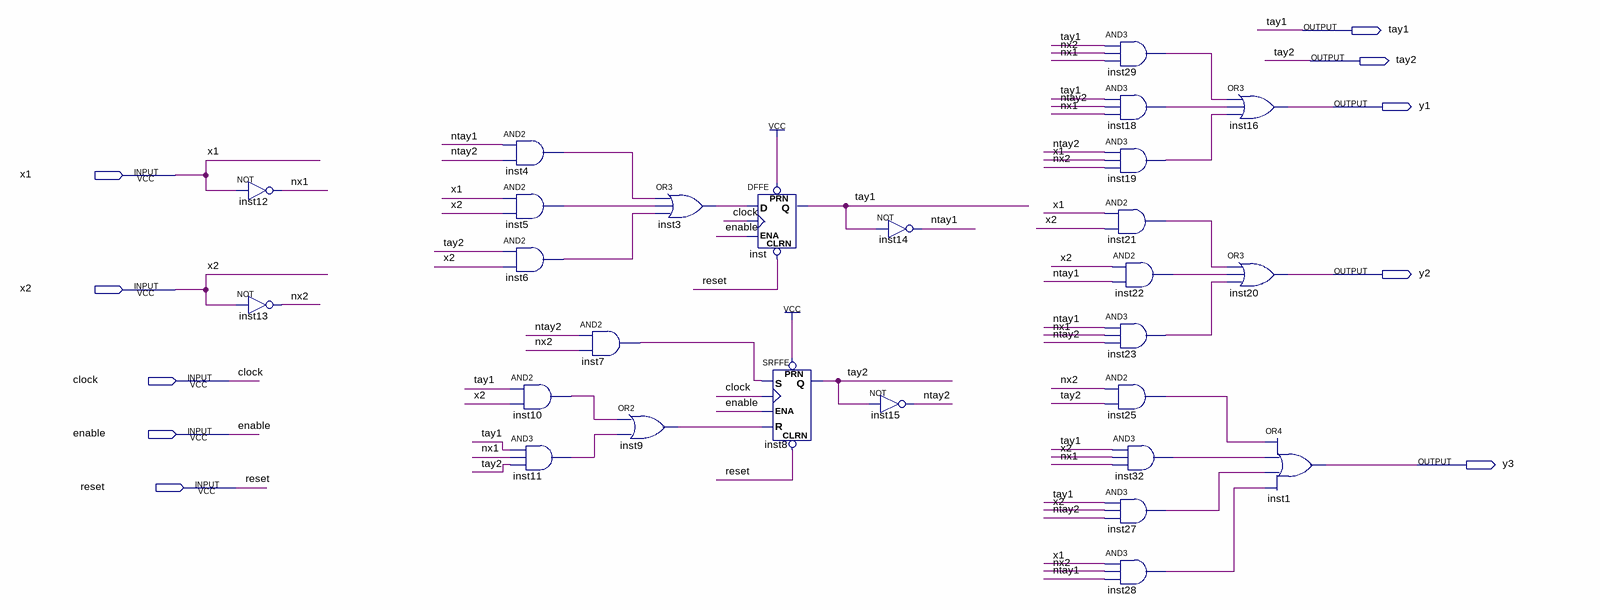
[diagram p0: schematic sheet]
// Quartus schematic avtomat_mili.bdf as structural Verilog: 27 symbols, 10 pins
module avtomat_mili (
  input  x1,
  input  x2,
  input  clock,
  input  enable,
  input  reset,
  output tay1,
  output tay2,
  output y1,
  output y2,
  output y3
);

  wire inst3_out, inst4_out, inst5_out, inst6_out, inst7_out, inst9_out, inst10_out, inst11_out, inst18_out,
       inst19_out, inst21_out, inst22_out, inst23_out, inst25_out, inst27_out, inst28_out, inst29_out,
       inst32_out, ntay1, ntay2, nx1, nx2;

  not inst12 (nx1, x1);
  not inst13 (nx2, x2);
  and inst4 (inst4_out, ntay1, ntay2);
  and inst5 (inst5_out, x1, x2);
  and inst6 (inst6_out, tay2, x2);
  and inst10 (inst10_out, tay1, x2);
  and inst11 (inst11_out, tay1, nx1, tay2);
  and inst7 (inst7_out, ntay2, nx2);
  or inst9 (inst9_out, inst10_out, inst11_out);
  or inst3 (inst3_out, inst4_out, inst5_out, inst6_out);
  DFFE inst (.PRN(1'b1), .CLRN(reset), .D(inst3_out), .CLK(clock), .ENA(enable), .Q(tay1));
  SRFFE inst8 (.PRN(1'b1), .S(inst7_out), .CLK(clock), .CLRN(reset), .R(inst9_out), .ENA(enable), .Q(tay2));
  not inst14 (ntay1, tay1);
  not inst15 (ntay2, tay2);
  and inst29 (inst29_out, tay1, nx2, nx1);
  and inst18 (inst18_out, tay1, ntay2, nx1);
  and inst19 (inst19_out, ntay2, x1, nx2);
  and inst21 (inst21_out, x1, x2);
  and inst22 (inst22_out, x2, ntay1);
  and inst23 (inst23_out, ntay1, nx1, ntay2);
  and inst25 (inst25_out, nx2, tay2);
  and inst32 (inst32_out, tay1, x2, nx1);
  and inst27 (inst27_out, tay1, x2, ntay2);
  and inst28 (inst28_out, x1, nx2, ntay1);
  or inst16 (y1, inst29_out, inst18_out, inst19_out);
  or inst20 (y2, inst21_out, inst22_out, inst23_out);
  or inst1 (y3, inst25_out, inst32_out, inst27_out, inst28_out);
endmodule
